# Altium schematic sheet Main.SchDoc: USB hub, interface
size A3; SheetNumber: 2; SheetTotal: 3
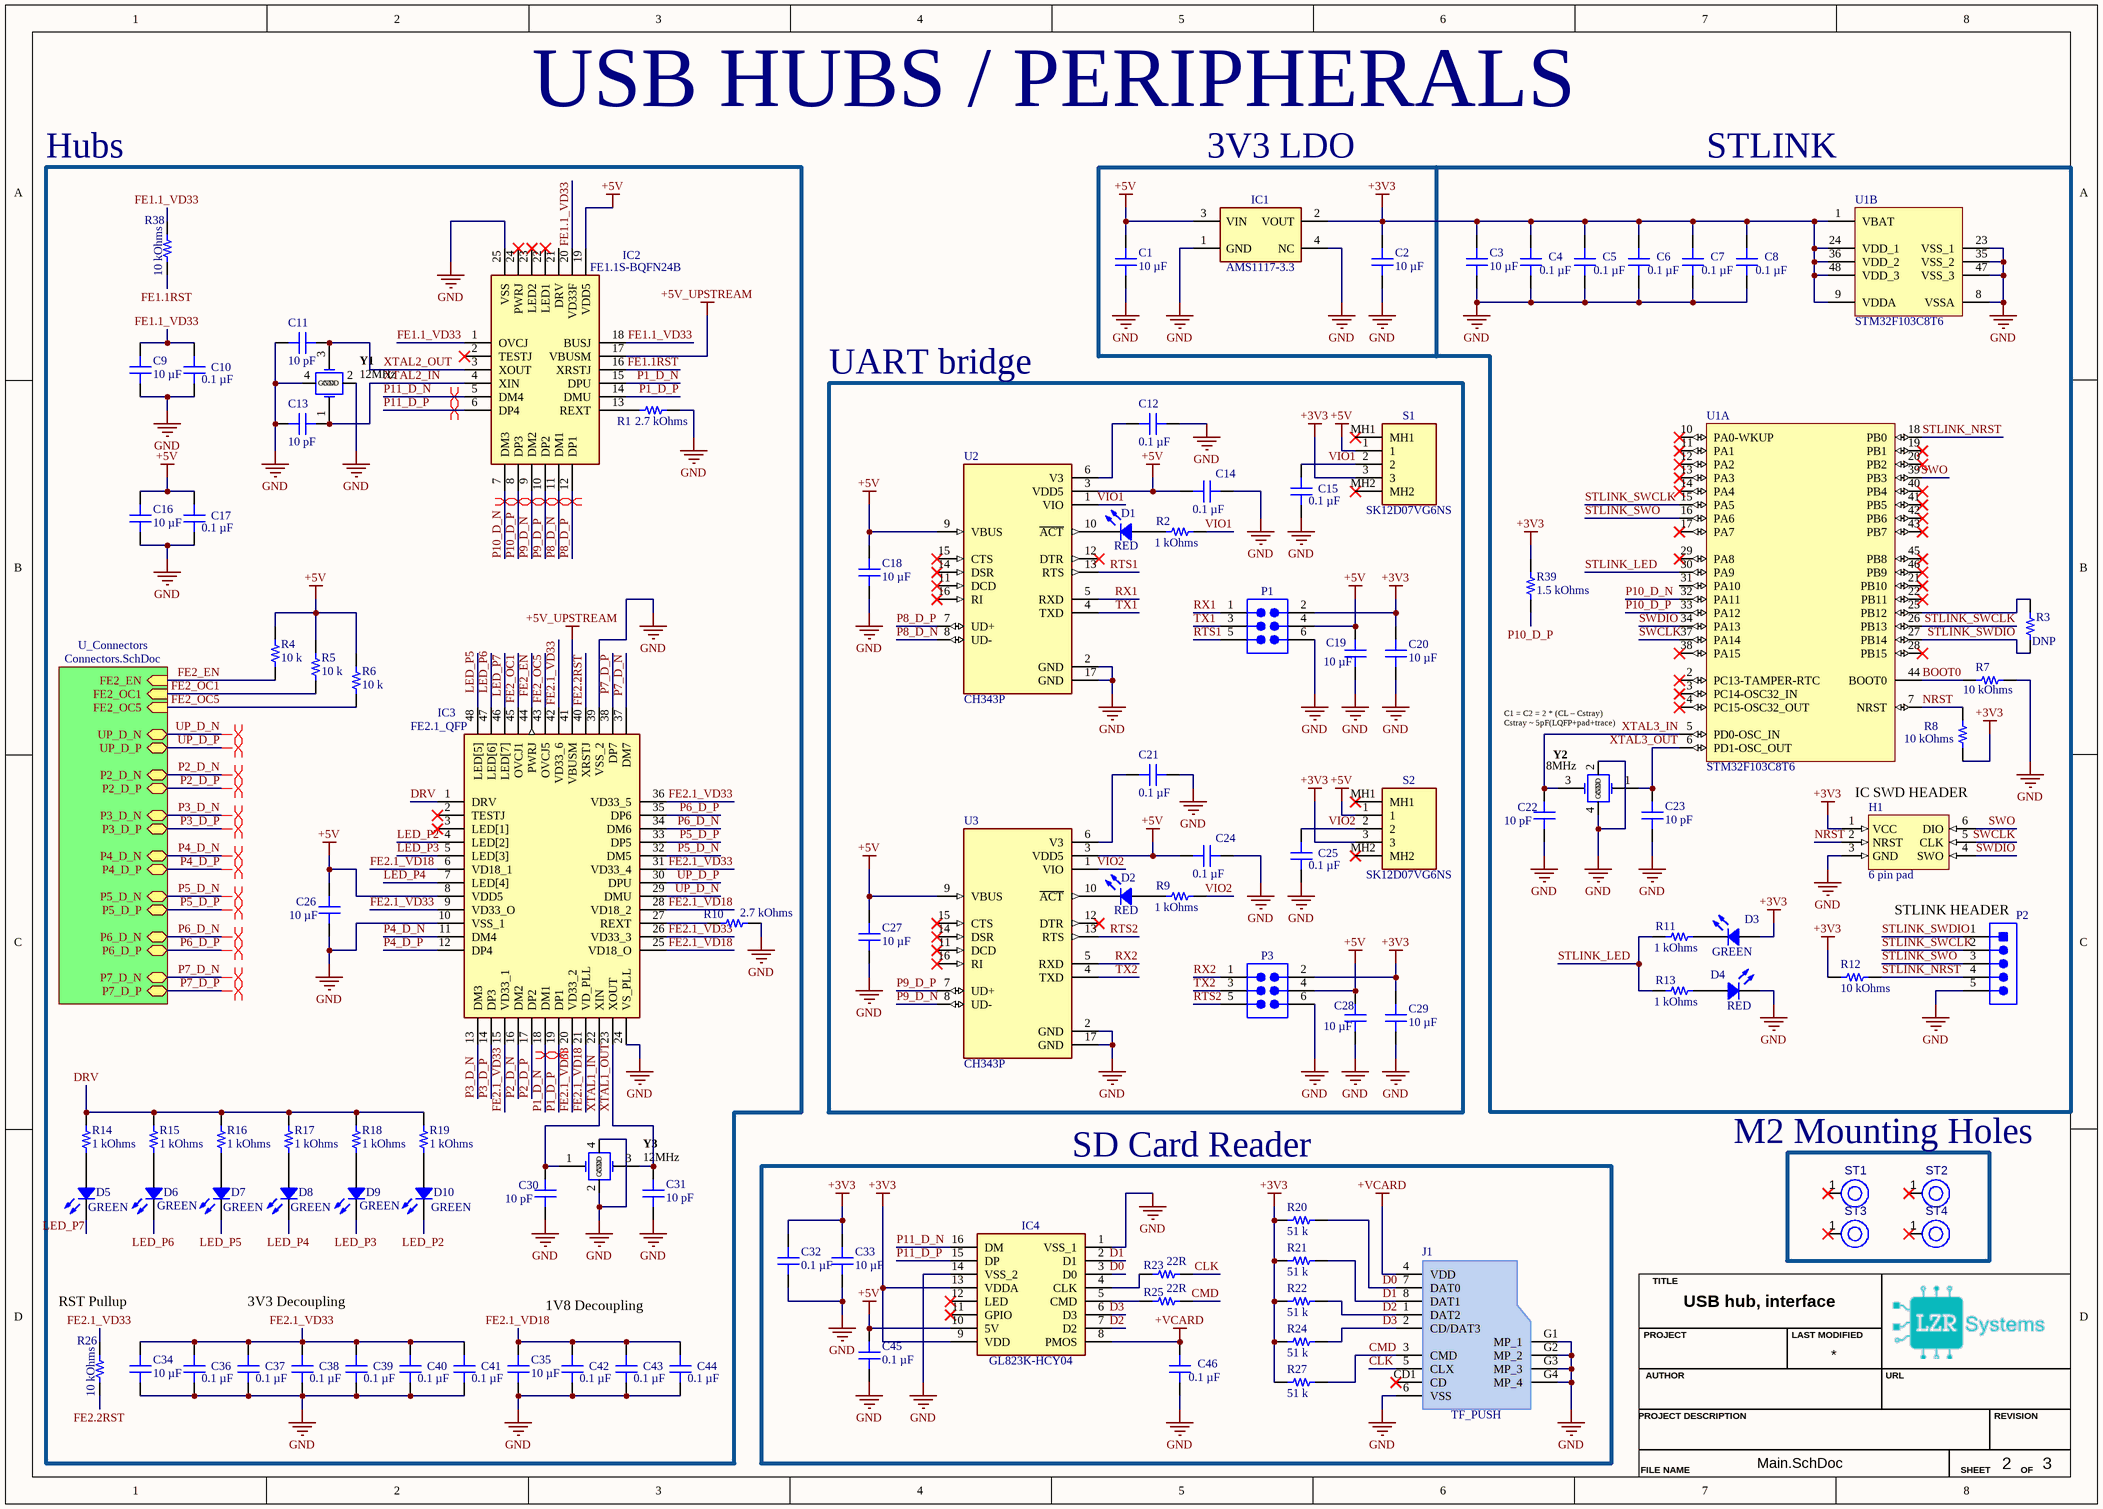
[diagram p0: Main.SchDoc]

## Parts
C1  10 µF  [MURATA GRM21B 0805_2012]
C2  10 µF  [MURATA GRM21B 0805_2012]
C3  10 µF  [MURATA GRM21B 0805_2012]
C4  0.1 µF  [CAP 0603_1608]
C5  0.1 µF  [CAP 0603_1608]
C6  0.1 µF  [CAP 0603_1608]
C7  0.1 µF  [CAP 0603_1608]
C8  0.1 µF  [CAP 0603_1608]
C9  10 µF  [MURATA GRM21B 0805_2012]
C10  0.1 µF  [CAP 0603_1608]
C11  10 pF  [MURATA GCM188 0603_1608]
C12  0.1 µF  [CAP 0603_1608]
C13  10 pF  [MURATA GCM188 0603_1608]
C14  0.1 µF  [CAP 0603_1608]
C15  0.1 µF  [CAP 0603_1608]
C16  10 µF  [MURATA GRM21B 0805_2012]
C17  0.1 µF  [CAP 0603_1608]
C18  10 µF  [MURATA GRM21B 0805_2012]
C19  10 µF  [MURATA GRM21B 0805_2012]
C20  10 µF  [MURATA GRM21B 0805_2012]
C21  0.1 µF  [CAP 0603_1608]
C22  10 pF  [MURATA GCM188 0603_1608]
C23  10 pF  [MURATA GCM188 0603_1608]
C24  0.1 µF  [CAP 0603_1608]
C25  0.1 µF  [CAP 0603_1608]
C26  10 µF  [MURATA GRM21B 0805_2012]
C27  10 µF  [MURATA GRM21B 0805_2012]
C28  10 µF  [MURATA GRM21B 0805_2012]
C29  10 µF  [MURATA GRM21B 0805_2012]
C30  10 pF  [MURATA GCM188 0603_1608]
C31  10 pF  [MURATA GCM188 0603_1608]
C32  0.1 µF  [CAP 0603_1608]
C33  10 µF  [MURATA GRM21B 0805_2012]
C34  10 µF  [MURATA GRM21B 0805_2012]
C35  10 µF  [MURATA GRM21B 0805_2012]
C36  0.1 µF  [CAP 0603_1608]
C37  0.1 µF  [CAP 0603_1608]
C38  0.1 µF  [CAP 0603_1608]
C39  0.1 µF  [CAP 0603_1608]
C40  0.1 µF  [CAP 0603_1608]
C41  0.1 µF  [CAP 0603_1608]
C42  0.1 µF  [CAP 0603_1608]
C43  0.1 µF  [CAP 0603_1608]
C44  0.1 µF  [CAP 0603_1608]
C45  0.1 µF  [CAP 0603_1608]
C46  0.1 µF  [CAP 0603_1608]
D1  RED  [LED 0603_1608 RED]
D2  RED  [LED 0603_1608 RED]
D3  GREEN  [LED 0603_1608 RED]
D4  RED  [LED 0603_1608 RED]
D5  GREEN  [LED 0603_1608 RED]
D6  GREEN  [LED 0603_1608 RED]
D7  GREEN  [LED 0603_1608 RED]
D8  GREEN  [LED 0603_1608 RED]
D9  GREEN  [LED 0603_1608 RED]
D10  GREEN  [LED 0603_1608 RED]
H1  6 pin pad  [6 pin pad-Footprint-1]
IC1  AMS1117-3.3  [SOT229P700X180-4N]
IC2  FE1.1S-BQFN24B  [QFN50P400X400X80-25N-D]
IC3  FE2.1_QFP  [QFP50P900X900X160-48N]
IC4  GL823K-HCY04  [SOP64P600X175-16N]
J1  TF_PUSH  [TFPUSH]
P1  MTLW-103-06-G-D-180  [SMTC-MTLW-103-06-X-D-180]  (value not drawn)
P2  77311-462K05LF  [FCI-77311-5_V]  (value not drawn)
P3  MTLW-103-06-G-D-180  [SMTC-MTLW-103-06-X-D-180]  (value not drawn)
R1  2.7 kOhms  [RES 0805_2012]
R2  1 kOhms  [YAGEO RES 0603_1608]
R3  DNP  [YAGEO RES 0603_1608]
R4  10 k  [RES 0603_1608]
R5  10 k  [RES 0603_1608]
R6  10 k  [RES 0603_1608]
R7  10 kOhms  [RES 0603_1608]
R8  10 kOhms  [RES 0603_1608]
R9  1 kOhms  [YAGEO RES 0603_1608]
R10  2.7 kOhms  [RES 0805_2012]
R11  1 kOhms  [YAGEO RES 0603_1608]
R12  10 kOhms  [RES 0603_1608]
R13  1 kOhms  [YAGEO RES 0603_1608]
R14  1 kOhms  [YAGEO RES 0603_1608]
R15  1 kOhms  [YAGEO RES 0603_1608]
R16  1 kOhms  [YAGEO RES 0603_1608]
R17  1 kOhms  [YAGEO RES 0603_1608]
R18  1 kOhms  [YAGEO RES 0603_1608]
R19  1 kOhms  [YAGEO RES 0603_1608]
R20  51 k  [YAGEO RES 0603_1608]
R21  51 k  [YAGEO RES 0603_1608]
R22  51 k  [YAGEO RES 0603_1608]
R23  22R  [RES 0603_1608]
R24  51 k  [YAGEO RES 0603_1608]
R25  22R  [RES 0603_1608]
R26  10 kOhms  [RES 0603_1608]
R27  51 k  [YAGEO RES 0603_1608]
R38  10 kOhms  [RES 0603_1608]
R39  1.5 kOhms  [RES 0603_1608]
S1  SK12D07VG6NS  [SK12D07VG6NS]
S2  SK12D07VG6NS  [SK12D07VG6NS]
ST1  PTH-M2D5X5  [PTH-M2D5X5]  (value not drawn)
ST2  PTH-M2D5X5  [PTH-M2D5X5]  (value not drawn)
ST3  PTH-M2D5X5  [PTH-M2D5X5]  (value not drawn)
ST4  PTH-M2D5X5  [PTH-M2D5X5]  (value not drawn)
U1  STM32F103C8T6  [STM-LQFP48_L]  (parts A,B of 2)
U2  CH343P  [QFN50P300X300X80-17N]
U3  CH343P  [QFN50P300X300X80-17N]
Y1  12MHz  [Yajingxin TX32258M4DBDD2T-Footprint-1]
Y2  8MHz  [Yajingxin TX32258M4DBDD2T-Footprint-1]
Y3  12MHz  [Yajingxin TX32258M4DBDD2T-Footprint-1]

## Blocks framed on the sheet
Hubs: C9-C11 C13 C16 C17 C26 C30 C31 C34-C44 D5-D10 IC2 IC3 R1 R4-R6 R10 R14-R19 R26 R38 Y1 Y3
UART bridge: C12 C14 C15 C18-C21 C24 C25 C27-C29 D1 D2 P1 P3 R2 R9 S1 S2 U2 U3
SD Card Reader: C32 C33 C45 C46 IC4 J1 R20-R25 R27

## Sub-sheets
U_Connectors = Connectors.SchDoc: FE2_EN (in), FE2_OC1 (in), FE2_OC5 (in), UP_D_P (bidir), UP_D_N (bidir), P3_D_N (bidir), P3_D_P (bidir), P4_D_N (bidir), P4_D_P (bidir), P2_D_N (bidir), P2_D_P (bidir), P6_D_N (bidir), P6_D_P (bidir), P5_D_N (bidir), P5_D_P (bidir), P7_D_N (bidir), P7_D_P (bidir)

## Nets
+3V3: C2.2 C3.2 C4.2 C5.2 C6.2 C7.2 C8.2 C20.2 C29.2 C32.2 C33.2 D3.1 H1.1(VCC) IC1.2(VOUT) IC4.9(VDD) IC4.13(VDDA) P1.2 P3.2 R8.2 R12.2 R20.2 R21.2 R22.2 R24.2 R27.2 R39.2 S1.3 S2.3 U1.1(VBAT) U1.9(VDDA) U1.24(VDD_1) U1.36(VDD_2) U1.48(VDD_3)
+5V: C1.2 C14.2 C16.2 C17.1 C18.2 C19.2 C24.2 C26.2 C27.2 C28.2 C45.2 IC1.3(VIN) IC2.19(VDD5) IC3.8(VDD5) IC4.10(5V) P1.4 P3.4 R4.1 R5.1 R6.1 S1.1 S2.1 U2.3(VDD5) U2.9(VBUS) U3.3(VDD5) U3.9(VBUS)
+5V_UPSTREAM: IC2.17(VBUSM) IC3.41(VBUSM)
+VCARD: C46.2 IC4.8(PMOS) J1.4(VDD)
GND: C1.1 C2.1 C3.1 C4.1 C5.1 C6.1 C7.1 C8.1 C9.1 C10.2 C11.2 C12.1 C13.2 C14.1 C15.2 C16.1 C17.2 C18.1 C19.1 C20.1 C21.1 C22.1 C23.1 C24.1 C25.2 C26.1 C27.1 C28.1 C29.1 C30.1 C31.1 C32.1 C33.1 C34.1 C35.1 C36.2 C37.2 C38.2 C39.2 C40.2 C41.2 C42.2 C43.2 C44.2 C45.1 C46.1 D4.2 H1.3(GND) IC1.1(GND) IC1.4(NC) IC2.25(VSS) IC3.10(VSS_1) IC3.24(VS_PLL) IC3.39(VSS_2) IC4.1(VSS_1) IC4.14(VSS_2) J1.6(VSS) J1.G1(MP_1) J1.G2(MP_2) J1.G3(MP_3) J1.G4(MP_4) P1.6 P2.5(CTS) P3.6 R1.2 R7.1 R10.2 U1.8(VSSA) U1.23(VSS_1) U1.35(VSS_2) U1.47(VSS_3) U2.2(GND) U2.17(GND) U3.2(GND) U3.17(GND) Y1.2(GND) Y1.4(GND) Y2.2(GND) Y2.4(GND) Y3.2(GND) Y3.4(GND)
BOOT0: R7.2 U1.44(BOOT0)
CLK: J1.5(CLX) R23.2
CMD: J1.3(CMD) R25.2 R27.1
D0: IC4.3(D0) J1.7(DAT0) R20.1
D1: IC4.2(D1) J1.8(DAT1) R21.1
D2: IC4.7(D2) J1.1(DAT2) R22.1
D3: IC4.6(D3) J1.2(CD/DAT3) R24.1
DRV: IC3.1(DRV) R14.2 R15.2 R16.2 R17.2 R18.2 R19.2
FE1.1_VD33: C9.2 C10.1 IC2.1(OVCJ) IC2.18(BUSJ) IC2.20(VD33F) R38.1
FE1.1RST: IC2.16(XRSTJ) R38.2
FE2.1_VD18: C35.2 C42.1 C43.1 C44.1 IC3.6(VD18_1) IC3.21(VD_PLL) IC3.25(VD18_O) IC3.28(VD18_2)
FE2.1_VD33: C34.2 C36.1 C37.1 C38.1 C39.1 C40.1 C41.1 IC3.9(VD33_O) IC3.15(VD33_1) IC3.20(VD33_2) IC3.26(VD33_3) IC3.31(VD33_4) IC3.36(VD33_5) IC3.42(VD33_6) R26.1
FE2.2RST: IC3.40(XRSTJ) R26.2
FE2_EN: IC3.44(PWRJ) R4.2 ; sheet U_Connectors/FE2_EN
FE2_OC1: IC3.45(OVCJ1) R5.2 ; sheet U_Connectors/FE2_OC1
FE2_OC5: IC3.43(OVCJ5) R6.2 ; sheet U_Connectors/FE2_OC5
LED_P2: D10.2 IC3.4(LED[2])
LED_P3: D9.2 IC3.5(LED[3])
LED_P4: D8.2 IC3.7(LED[4])
LED_P5: D7.2 IC3.48(LED[5])
LED_P6: D6.2 IC3.47(LED[6])
LED_P7: D5.2 IC3.46(LED[7])
NRST: H1.2(NRST) R8.1 U1.7(NRST)
P1_D_N: IC2.15(DPU) IC3.18(DM1)
P1_D_P: IC2.14(DMU) IC3.19(DP1)
P2_D_N: IC3.16(DM2) ; sheet U_Connectors/P2_D_N
P2_D_P: IC3.17(DP2) ; sheet U_Connectors/P2_D_P
P3_D_N: IC3.13(DM3) ; sheet U_Connectors/P3_D_N
P3_D_P: IC3.14(DP3) ; sheet U_Connectors/P3_D_P
P4_D_N: IC3.11(DM4) ; sheet U_Connectors/P4_D_N
P4_D_P: IC3.12(DP4) ; sheet U_Connectors/P4_D_P
P5_D_N: IC3.32(DM5) ; sheet U_Connectors/P5_D_N
P5_D_P: IC3.33(DP5) ; sheet U_Connectors/P5_D_P
P6_D_N: IC3.34(DM6) ; sheet U_Connectors/P6_D_N
P6_D_P: IC3.35(DP6) ; sheet U_Connectors/P6_D_P
P7_D_N: IC3.37(DM7) ; sheet U_Connectors/P7_D_N
P7_D_P: IC3.38(DP7) ; sheet U_Connectors/P7_D_P
P8_D_N: IC2.11(DM1) U2.8(UD-)
P8_D_P: IC2.12(DP1) U2.7(UD+)
P9_D_N: IC2.9(DM2) U3.8(UD-)
P9_D_P: IC2.10(DP2) U3.7(UD+)
P10_D_N: IC2.7(DM3) U1.32(PA11)
P10_D_P: IC2.8(DP3) R39.1 U1.33(PA12)
P11_D_N: IC2.5(DM4) IC4.16(DM)
P11_D_P: IC2.6(DP4) IC4.15(DP)
RTS1: P1.5 U2.13(RTS)
RTS2: P3.5 U3.13(RTS)
RX1: P1.1 U2.5(RXD)
RX2: P3.1 U3.5(RXD)
STLINK_LED: R11.1 R13.1 U1.30(PA9)
STLINK_NRST: P2.4(VCC) R12.1 U1.18(PB0)
STLINK_SWCLK: P2.2(RXI) U1.15(PA5) U1.26(PB13)
STLINK_SWDIO: P2.1(DTR) R3.1 U1.27(PB14)
STLINK_SWO: P2.3(TXO) U1.16(PA6)
SWCLK: H1.5(CLK) U1.37(PA14)
SWDIO: H1.4(SWO) U1.34(PA13)
SWO: H1.6(DIO) U1.39(PB3)
TX1: P1.3 U2.4(TXD)
TX2: P3.3 U3.4(TXD)
UP_D_N: IC3.29(DMU) ; sheet U_Connectors/UP_D_N
UP_D_P: IC3.30(DPU) ; sheet U_Connectors/UP_D_P
VIO1: C15.1 R2.2 S1.2 U2.1(VIO)
VIO2: C25.1 R9.2 S2.2 U3.1(VIO)
XTAL1_IN: C30.2 IC3.22(XIN) Y3.1
XTAL1_OUT: C31.2 IC3.23(XOUT) Y3.3
XTAL2_IN: C13.1 IC2.4(XIN) Y1.1
XTAL2_OUT: C11.1 IC2.3(XOUT) Y1.3
XTAL3_IN: C22.2 U1.5(PD0-OSC_IN) Y2.3
XTAL3_OUT: C23.2 U1.6(PD1-OSC_OUT) Y2.1
NetC12_2: C12.2 U2.6(V3)
NetC21_2: C21.2 U3.6(V3)
NetD1_1: D1.1 R2.1
NetD1_2: D1.2 U2.10(~{ACT})
NetD2_1: D2.1 R9.1
NetD2_2: D2.2 U3.10(~{ACT})
NetD3_2: D3.2 R11.2
NetD4_1: D4.1 R13.2
NetD5_1: D5.1 R14.1
NetD6_1: D6.1 R15.1
NetD7_1: D7.1 R16.1
NetD8_1: D8.1 R17.1
NetD9_1: D9.1 R18.1
NetD10_1: D10.1 R19.1
NetIC2_13: IC2.13(REXT) R1.1
NetIC3_27: IC3.27(REXT) R10.1
NetIC4_4: IC4.4(CLK) R23.1
NetIC4_5: IC4.5(CMD) R25.1
NetR3_2: R3.2 U1.25(PB12)

Not connected (* = marked no-connect by the designer): IC2 2(TESTJ)* 21(DRV) 22(LED1)* 23(LED2)* 24(PWRJ)*; IC3 2(TESTJ)* 3(LED[1])*; IC4 11(GPIO)* 12(LED)*; J1 CD1(CD)*; S1 MH1* MH2*; S2 MH1* MH2*; ST1 1(H1)*; ST2 1(H1)*; ST3 1(H1)*; ST4 1(H1)*; U1 2(PC13-TAMPER-RTC)* 3(PC14-OSC32_IN)* 4(PC15-OSC32_OUT)* 10(PA0-WKUP)* 11(PA1)* 12(PA2)* 13(PA3)* 14(PA4)* 17(PA7)* 19(PB1)* 20(PB2)* 21(PB10)* 22(PB11)* 28(PB15)* 29(PA8)* 31(PA10) 38(PA15)* 40(PB4)* 41(PB5)* 42(PB6)* 43(PB7)* 45(PB8)* 46(PB9)*; U2 11(DCD)* 12(DTR)* 14(DSR)* 15(CTS)* 16(RI)*; U3 11(DCD)* 12(DTR)* 14(DSR)* 15(CTS)* 16(RI)*

## Layout directives
differential pair: P1_D_N, P1_D_P, P2_D_N, P2_D_P, P3_D_N, P3_D_P, P4_D_N, P4_D_P, P5_D_N, P5_D_P, P6_D_N, P6_D_P, P7_D_N, P7_D_P, P8_D_N, P8_D_P, P9_D_N, P9_D_P, P10_D_N, P10_D_P, P11_D_N, P11_D_P, UP_D_N, UP_D_P

## Notes on the sheet
- USB HUBS / PERIPHERALS
- 3V3 LDO
- STLINK
- (near Y2) C1 = C2 = 2 * (CL – Cstray)
  Cstray ~ 5pF(LQFP+pad+trace)
- IC SWD HEADER
- (near P2) STLINK HEADER
- M2 Mounting Holes
- RST Pullup
- 3V3 Decoupling
- 1V8 Decoupling
- TITLE
- AUTHOR
- PROJECT
- LAST MODIFIED
- URL
- PROJECT DESCRIPTION
- REVISION
- FILE NAME
- SHEET
- OF

## Library data of the parts
C1-C3 C9 C16 C18-C20 C26-C29 C33-C35 = GRM21BR61E106KA73K: CAP CER 10UF 25V X5R 0805; manufacturer: Murata Electronics; Tolerance: ±10%; Part Number: GRM21BR61E106KA73K; Capacitance: 10 µF; Applications: General Purpose; componentlink1description: Datasheet; componentlink1url: https://search.murata.co.jp/Ceramy/image/img/A01X/G101/ENG/GRM21BR61E106KA73-01.pdf; componentlink2description: DigiKey Link; componentlink2url: https://www.digikey.com/en/products/detail/murata-electronics/GRM21BR61E106KA73K/4905532; Device Package: 0805 (2012 Metric); lastupdated: 8/27/2024 9:29:55 AM; Lifecycle Status: Active; Minimum Order: 1; Mounting Type: Surface Mount, MLCC; Operating Temperature: -55°C ~ 85°C; Package / Case: 0805 (2012 Metric); packaging: TapeAndReel; partid: 15140; Part Status: Active; price: 0.02; series: GRM; Size / Dimension: 0.079" L x 0.049" W (2.00mm x 1.25mm); Supplier 1: DigiKey; Supplier Part Number 1: 490-16824-1-ND; Temperature Coefficient: X5R; Thickness (Max): 0.055" (1.40mm); value: 10 µF; Voltage - Rated: 25V
C4-C8 C10 C12 C14 C15 C17 C21 C24 C25 C32 C36-C46 = GCJ188R71H104KA12D: CAP CER 0.1UF 50V X7R 0603; manufacturer: Murata Electronics; Tolerance: ±10%; Part Number: GCJ188R71H104KA12D; Capacitance: 0.1 µF; Applications: Automotive, Boardflex Sensitive; componentlink1description: Datasheet; componentlink1url: https://www.murata.com/~/media/webrenewal/support/library/catalog/products/capacitor/mlcc/c03e.ashx?la=en-us; componentlink2description: DigiKey Link; componentlink2url: https://www.digikey.com/en/products/detail/murata-electronics/GCJ188R71H104KA12D/2783803; Device Package: 0603 (1608 Metric); Features: Soft Termination; lastupdated: 2/9/2024 8:10:08 PM; Lifecycle Status: Active; Minimum Order: 1; Mounting Type: Surface Mount, MLCC; Operating Temperature: -55°C ~ 125°C; Package / Case: 0603 (1608 Metric); packaging: TapeAndReel; partid: 16867; Part Status: Active; price: 0.01; Ratings: AEC-Q200; series: GCJ; Size / Dimension: 0.063" L x 0.031" W (1.60mm x 0.80mm); Supplier 1: DigiKey; Supplier Part Number 1: 490-5798-1-ND; Temperature Coefficient: X7R; Thickness (Max): 0.035" (0.90mm); value: 0.1 µF; Voltage - Rated: 50V
C11 C13 C22 C23 C30 C31 = GCM1885C2A100FA16D: CAP CER 10PF 100V C0G/NP0 0603; manufacturer: Murata Electronics; Temperature Coefficient: C0G, NP0; Tolerance: ±1%; Part Number: GCM1885C2A100FA16D; Capacitance: 10 pF; Applications: Automotive; componentlink1description: Datasheet; componentlink1url: https://search.murata.co.jp/Ceramy/image/img/A01X/G101/ENG/GCM1885C2A100FA16-01.pdf; componentlink2description: DigiKey Link; componentlink2url: https://www.digikey.com/en/products/detail/murata-electronics/GCM1885C2A100FA16D/11618736; Device Package: 0603 (1608 Metric); lastupdated: 7/20/2024 12:24:59 AM; Lifecycle Status: Active; Minimum Order: 1; Mounting Type: Surface Mount, MLCC; Operating Temperature: -55°C ~ 125°C; Package / Case: 0603 (1608 Metric); packaging: TapeAndReel; partid: 36047; Part Status: Active; price: 0.02; Ratings: AEC-Q200; series: GCM; Size / Dimension: 0.063" L x 0.031" W (1.60mm x 0.80mm); Supplier 1: DigiKey; Supplier Part Number 1: 490-GCM1885C2A100FA16DCT-ND; Thickness (Max): 0.035" (0.90mm); value: 10 pF; Voltage - Rated: 100V
D1-D10 = B1931URO-20D000114U1930: LED RED DIFFUSED 0603 SMD; Manufacturer: Harvatek Corporation; Current - Test: 20mA; Lens Size: 1.00mm x 0.80mm; Lens Style: Rectangle with Flat Top; Millicandela Rating: 45mcd; Viewing Angle: 125°, 135°; Voltage - Forward (Vf) (Typ): 2V; Wavelength - Peak: 639nm; Part Number: B1931URO-20D000114U1930; Color: Red; ComponentLink2Description: DigiKey Link; ComponentLink2URL: https://www.digikey.com/en/products/detail/harvatek-corporation/B1931URO-20D000114U1930/15910603; Device Package: 0603 (1608 Metric); LastUpdated: 6/3/2024 7:59:45 PM; Lens Transparency: Diffused; Lifecycle Status: Active; Minimum Order: 1; Mounting Type: Surface Mount; Package / Case: 0603 (1608 Metric); Packaging: TapeAndReel; PartId: 1009; Part Status: Active; Price: 0.04; Series: -; Size / Dimension: 1.60mm L x 0.80mm W; Supplier 1: DigiKey; Supplier Part Number 1: 3147-B1931URO-20D000114U1930CT-ND; Supplier Device Package: 0603
H1 = CMP-002-00084-1
IC1 = AMS1117-3.3: Integrated Circuit; Manufacturer_Name: Advanced; Datasheet Link: https://datasheet.datasheetarchive.com/originals/distributors/Datasheets-28/DSA-550594.pdf; Height: 1.8mm; Manufacturer_Part_Number: AMS1117-3.3
IC2 = FE1.1S-BQFN24B: Integrated Circuit; Manufacturer_Name: Terminus Technology; Datasheet Link: https://datasheet.lcsc.com/lcsc/2306141021_Terminus-Tech-FE1-1S-BQFN24B_C6776948.pdf; Height: 0.8mm; Manufacturer_Part_Number: FE1.1S-BQFN24B
IC3 = FE2.1_QFP: Integrated Circuit; Manufacturer_Name: Terminus Technology; Height: 1.6mm; Manufacturer_Part_Number: FE2.1_QFP
IC4 = GL823K-HCY04: Integrated Circuit; Manufacturer_Name: Genesys; Datasheet Link: https://www.lcsc.com/datasheet/C284879.pdf; Height: 1.75mm; Manufacturer_Part_Number: GL823K-HCY04
J1 = TF_PUSH: Connector; Manufacturer_Name: Shou Han; Manufacturer_Part_Number: TF PUSH; Datasheet Link: https://datasheet.lcsc.com/szlcsc/1912111437_SHOU-HAN-TF-PUSH_C393941.pdf; Height: 2mm
P1 P3 = CMP-002-00079-1: Pin Header, Board-to-Board, 2.54 mm, 2 Rows, 6 Contacts, Through Hole, MTLW Series; Max Operating Temperature: 125°C; Min Operating Temperature: -55°C
P2 = CMP-002-00021-2: Male Header, Pitch 2.54 mm, 1 x 5 Position, Height 16.24 mm, Tail Length 3.05 mm, -65 to 125 degC, RoHS, Tape and Reel; Manufacturer: FCI Electronics; Connector Type: Header; Manufacturer URL: http://portal.fciconnect.com/; Datasheet URL: http://portal.fciconnect.com/Comergent//fci/drawing/77311.pdf; Gender: Male; Case/Package: 77311-5; Package Reference: 77311-5; Datasheet Version: Rev. CK, 07/2016; Package Description: Male Header, Pitch 2.54 mm, 1 x 5 Position, Height 16.24 mm, Tail Length 3.05 mm; RoHS Compliant: Unknown; Mounting Technology: TH
R1 R10 = RTAN0805BKE2K70: RES 2.7K OHM 0.1% 1/5W 0805; Manufacturer: Stackpole Electronics Inc; Power (Watts): 0.2W, 1/5W; Temperature Coefficient: ±25ppm/°C; Part Number: RTAN0805BKE2K70; Value: 2.7 kOhms; ComponentLink1Description: Datasheet; ComponentLink1URL: https://www.seielect.com/catalog/sei-rtan.pdf; ComponentLink2Description: DigiKey Link; ComponentLink2URL: http://digikey.com/product-detail/en/stackpole-electronics-inc/RTAN0805BKE2K70/RTAN0805BKE2K70CT-ND/6602266; Composition: Thin Film; Device Package: 0805 (2012 Metric); Features: Anti-Sulfur, Automotive AEC-Q200, Moisture Resistant; Height - Seated (Max): 0.026" (0.65mm); LastUpdated: 2/8/2024 9:02:20 PM; Lifecycle Status: Active; Minimum Order: 1; Number of Terminations: 2; Operating Temperature: -55°C ~ 155°C; Package / Case: 0805 (2012 Metric); Packaging: TapeAndReel; PartId: 31922; Part Status: Active; Price: 0.17; Ratings: AEC-Q200; Resistance: 2.7 kOhms; Series: RTAN; Size / Dimension: 0.079" L x 0.049" W (2.00mm x 1.25mm); Supplier 1: DigiKey; Supplier Part Number 1: RTAN0805BKE2K70CT-ND; Supplier Device Package: 0805; Tolerance: ±0.1%
R2 R9 R11 R13-R19 = RT0603FRE071KL: RES SMD 1K OHM 1% 1/10W 0603; Manufacturer: Yageo; Power (Watts): 0.1W, 1/10W; Temperature Coefficient: ±50ppm/°C; Part Number: RT0603FRE071KL; Value: 1 kOhms; ComponentLink1Description: Datasheet; ComponentLink1URL: https://www.yageo.com/upload/media/product/productsearch/datasheet/rchip/PYu-RT_1-to-0.01_RoHS_L_11.pdf; ComponentLink2Description: DigiKey Link; ComponentLink2URL: https://www.digikey.com/en/products/detail/yageo/RT0603FRE071KL/1075188; Composition: Thin Film; Device Package: 0603 (1608 Metric); Height - Seated (Max): 0.022" (0.55mm); LastUpdated: 7/25/2024 9:19:32 AM; Lifecycle Status: Active; Minimum Order: 1; Number of Terminations: 2; Operating Temperature: -55°C ~ 155°C; Package / Case: 0603 (1608 Metric); Packaging: TapeAndReel; PartId: 5672; Part Status: Active; Price: 0.01; Resistance: 1 kOhms; Series: RT; Size / Dimension: 0.063" L x 0.031" W (1.60mm x 0.80mm); Supplier 1: DigiKey; Supplier Part Number 1: YAG2323CT-ND; Supplier Device Package: 0603; Tolerance: ±1%
R3 = RT0603FRE071KL: RES SMD 1K OHM 1% 1/10W 0603; Manufacturer: Yageo; Power (Watts): 0.1W, 1/10W; Resistance: 1 kOhms; Temperature Coefficient: ±50ppm/°C; Part Number: RT0603FRE071KL; Value: DNP; ComponentLink1Description: Datasheet; ComponentLink1URL: https://www.yageo.com/upload/media/product/productsearch/datasheet/rchip/PYu-RT_1-to-0.01_RoHS_L_11.pdf; ComponentLink2Description: DigiKey Link; ComponentLink2URL: https://www.digikey.com/en/products/detail/yageo/RT0603FRE071KL/1075188; Composition: Thin Film; Device Package: 0603 (1608 Metric); Height - Seated (Max): 0.022" (0.55mm); LastUpdated: 7/25/2024 9:19:32 AM; Lifecycle Status: Active; Minimum Order: 1; Number of Terminations: 2; Operating Temperature: -55°C ~ 155°C; Package / Case: 0603 (1608 Metric); Packaging: TapeAndReel; PartId: 5672; Part Status: Active; Price: 0.01; Series: RT; Size / Dimension: 0.063" L x 0.031" W (1.60mm x 0.80mm); Supplier 1: DigiKey; Supplier Part Number 1: YAG2323CT-ND; Supplier Device Package: 0603; Tolerance: ±1%
R4-R6 = CRCW060310K0JNEAC: RES 10K OHM 5% 1/10W 0603; Manufacturer: Vishay Dale; Power (Watts): 0.1W, 1/10W; Resistance: 10 kOhms; Temperature Coefficient: ±200ppm/°C; Part Number: CRCW060310K0JNEAC; Value: 10 k; ComponentLink1Description: Datasheet; ComponentLink1URL: http://www.vishay.com/docs/28773/crcwce3.pdf; ComponentLink2Description: DigiKey Link; ComponentLink2URL: https://www.digikey.com/en/products/detail/vishay-dale/CRCW060310K0JNEAC/7928379; Composition: Thick Film; Device Package: 0603 (1608 Metric); Height - Seated (Max): 0.022" (0.55mm); LastUpdated: 2/9/2024 8:42:33 PM; Lifecycle Status: Active; Minimum Order: 1; Number of Terminations: 2; Operating Temperature: -55°C ~ 155°C; Package / Case: 0603 (1608 Metric); Packaging: CutTape; PartId: 21155; Part Status: Active; Price: 0.01; Series: CRCW-C; Supplier 1: DigiKey; Supplier Part Number 1: 541-3957-1-ND; Supplier Device Package: 0603; Tolerance: ±5%
R7 R8 R12 R26 R38 = CRCW060310K0JNEAC: RES 10K OHM 5% 1/10W 0603; Manufacturer: Vishay Dale; Power (Watts): 0.1W, 1/10W; Temperature Coefficient: ±200ppm/°C; Part Number: CRCW060310K0JNEAC; Value: 10 kOhms; ComponentLink1Description: Datasheet; ComponentLink1URL: http://www.vishay.com/docs/28773/crcwce3.pdf; ComponentLink2Description: DigiKey Link; ComponentLink2URL: https://www.digikey.com/en/products/detail/vishay-dale/CRCW060310K0JNEAC/7928379; Composition: Thick Film; Device Package: 0603 (1608 Metric); Height - Seated (Max): 0.022" (0.55mm); LastUpdated: 2/9/2024 8:42:33 PM; Lifecycle Status: Active; Minimum Order: 1; Number of Terminations: 2; Operating Temperature: -55°C ~ 155°C; Package / Case: 0603 (1608 Metric); Packaging: CutTape; PartId: 21155; Part Status: Active; Price: 0.01; Resistance: 10 kOhms; Series: CRCW-C; Supplier 1: DigiKey; Supplier Part Number 1: 541-3957-1-ND; Supplier Device Package: 0603; Tolerance: ±5%
R20-R22 R24 R27 = RC0603FR-0751KL: RES 51K OHM 1% 1/10W 0603; Manufacturer: Yageo; Power (Watts): 0.1W, 1/10W; Resistance: 51 kOhms; Temperature Coefficient: ±100ppm/°C; Part Number: RC0603FR-0751KL; Value: 51 k; ComponentLink1Description: Datasheet; ComponentLink1URL: https://www.yageo.com/upload/media/product/productsearch/datasheet/rchip/PYu-RC_Group_51_RoHS_L_10.pdf; ComponentLink2Description: DigiKey Link; ComponentLink2URL: https://www.digikey.com/en/products/detail/yageo/RC0603FR-0751KL/727282; Composition: Thick Film; Device Package: 0603 (1608 Metric); Features: Moisture Resistant; Height - Seated (Max): 0.022" (0.55mm); LastUpdated: 7/25/2024 9:19:21 AM; Lifecycle Status: Active; Minimum Order: 1; Number of Terminations: 2; Operating Temperature: -55°C ~ 155°C; Package / Case: 0603 (1608 Metric); Packaging: CutTape; PartId: 18942; Part Status: Active; Price: 0.01; Series: RC_L; Size / Dimension: 0.063" L x 0.031" W (1.60mm x 0.80mm); Supplier 1: DigiKey; Supplier Part Number 1: 311-51.0KHRCT-ND; Supplier Device Package: 0603; Tolerance: ±1%
R23 R25 = RMCF0603FT22R0: RES 22 OHM 1% 1/10W 0603; Manufacturer: Stackpole Electronics Inc; Power (Watts): 0.1W, 1/10W; Resistance: 22 Ohms; Temperature Coefficient: ±100ppm/°C; Part Number: RMCF0603FT22R0; Value: 22R; ComponentLink1Description: Datasheet; ComponentLink1URL: https://www.seielect.com/catalog/sei-packaging.pdf; ComponentLink2Description: DigiKey Link; ComponentLink2URL: https://www.digikey.com/en/products/detail/stackpole-electronics-inc/RMCF0603FT22R0/1760726; Composition: Thick Film; Device Package: 0603 (1608 Metric); Features: Automotive AEC-Q200; Height - Seated (Max): 0.022" (0.55mm); LastUpdated: 2/9/2024 8:43:14 PM; Lifecycle Status: Active; Minimum Order: 1; Number of Terminations: 2; Operating Temperature: -55°C ~ 155°C; Package / Case: 0603 (1608 Metric); Packaging: CutTape; PartId: 10611; Part Status: Active; Price: 0.01; Ratings: AEC-Q200; Series: RMCF; Size / Dimension: 0.061" L x 0.031" W (1.55mm x 0.80mm); Supplier 1: DigiKey; Supplier Part Number 1: RMCF0603FT22R0CT-ND; Supplier Device Package: 0603; Tolerance: ±1%
R39 = RNCP0603FTD1K50: RES 1.5K OHM 1% 1/8W 0603; Manufacturer: Stackpole Electronics Inc; Power (Watts): 0.125W, 1/8W; Temperature Coefficient: ±100ppm/°C; Part Number: RNCP0603FTD1K50; Value: 1.5 kOhms; ComponentLink1Description: Datasheet; ComponentLink1URL: https://www.seielect.com/catalog/sei-rncp.pdf; ComponentLink2Description: DigiKey Link; ComponentLink2URL: https://www.digikey.com/en/products/detail/stackpole-electronics-inc/RNCP0603FTD1K50/2240110; Composition: Thin Film; Device Package: 0603 (1608 Metric); Features: Anti-Sulfur; Height - Seated (Max): 0.022" (0.55mm); LastUpdated: 2/9/2024 8:43:33 PM; Lifecycle Status: Active; Minimum Order: 1; Number of Terminations: 2; Operating Temperature: -55°C ~ 155°C; Package / Case: 0603 (1608 Metric); Packaging: TapeAndReel; PartId: 5700; Part Status: Active; Price: 0.01; Resistance: 1.5 kOhms; Series: RNCP; Size / Dimension: 0.061" L x 0.031" W (1.55mm x 0.80mm); Supplier 1: DigiKey; Supplier Part Number 1: RNCP0603FTD1K50CT-ND; Supplier Device Package: 0603; Tolerance: ±1%
S1 S2 = SK12D07VG6NS: Switch; Manufacturer_Name: C & K COMPONENTS; Datasheet Link: https://www.ckswitches.com/media/1432/sk.pdf; Height: 4.7mm; Manufacturer_Part_Number: SK12D07VG6NS; Mouser Part Number: 611-SK12D07VG6NS; Mouser Price/Stock: https://www.mouser.co.uk/ProductDetail/CK/SK12D07VG6NS?qs=Gufeu08L%2Fl2onKkgb1iMzw%3D%3D
ST1-ST4 = CMP-00028-00004-2: M2 PTH (2.5mm), 5mm pad; Pins: 1
U1 = CMP-020-00023-1: RISC Microcontroller, 32-Bit, FLASH, STM32 CPU, 72MHz, CMOS, PQFP48; Clock Frequency: 16MHz; Min Supply Voltage: 2V; Nominal Supply Voltage: 3.3V; Max Supply Voltage: 3.6V; Interface: I2C,SPI,USB,CAN,USART; Pins: 48; Min Operating Temperature: -40°C; Max Operating Temperature: 105°C; RoHS Compliant: Yes; Case/Package: LFQFP
U2 U3 = CMP-013-000000-1: USB to High-Speed Serial Chip CH343; MF: WCH; Pin Count: 17; Check_prices: https://www.snapeda.com/parts/CH343P/WCH/view-part/?ref=eda; Source: CH343P.SchLib; Component Type: Standard; Value: *; Package: Package; SnapEDA_Link: https://www.snapeda.com/parts/CH343P/WCH/view-part/?ref=snap; MP: CH343P; Design Item ID: CH343P
Y1-Y3 = CMP-003-00030-8: 8 MHz crystal, CL: 10pF, +/-10ppm